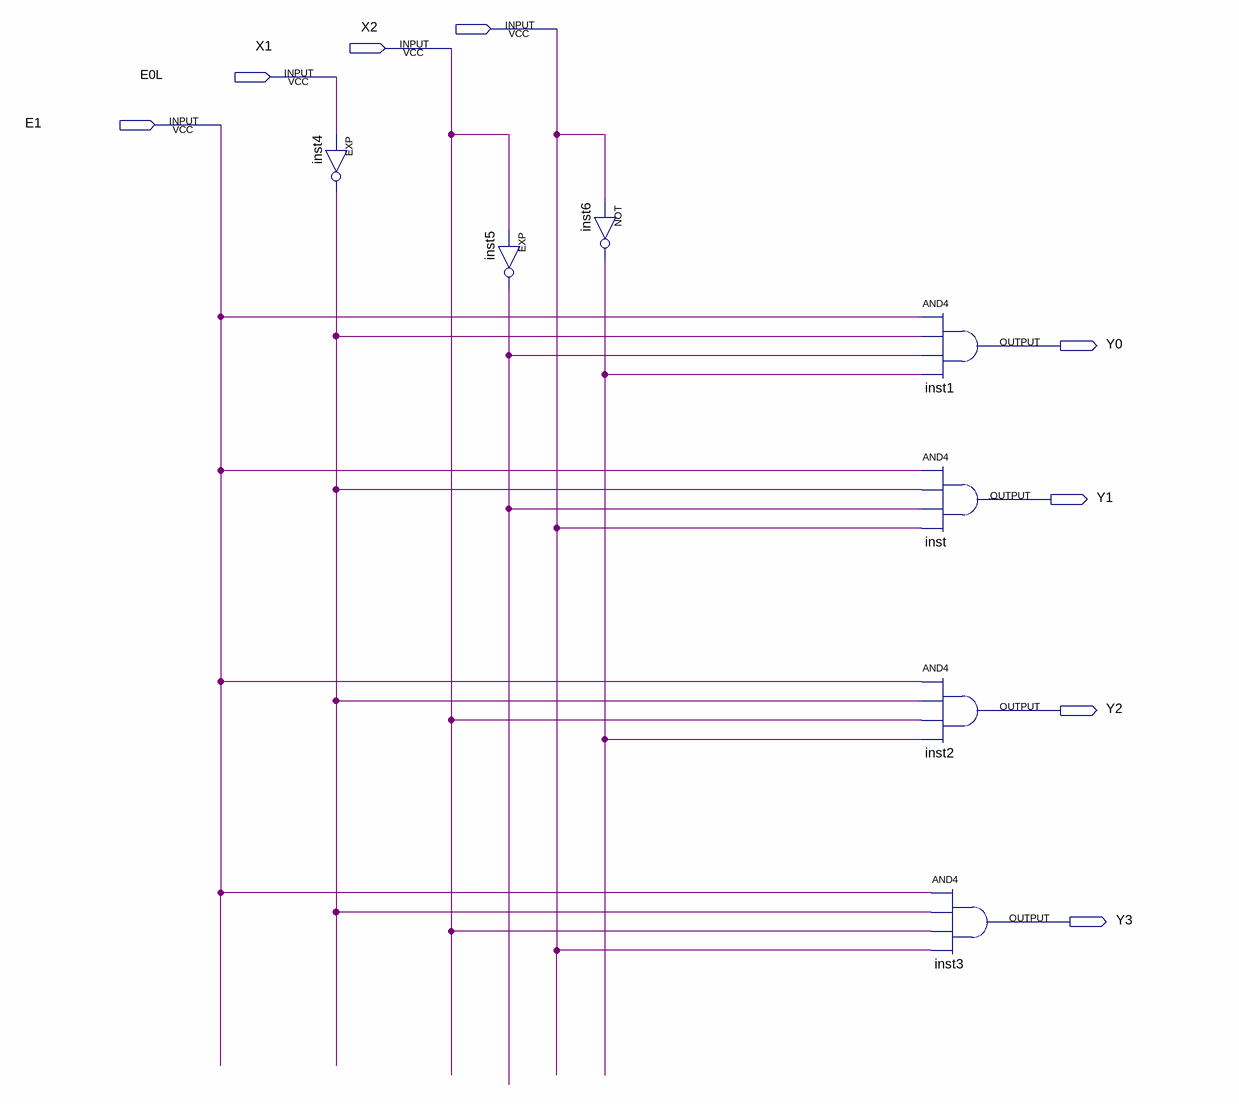
[diagram p0: schematic sheet]
// Quartus schematic Dec2_4.bdf as structural Verilog: 7 symbols, 8 pins
module Dec2_4 (
  input  X2,
  input  X1,
  input  E0L,
  input  E1,
  output Y0,
  output Y1,
  output Y2,
  output Y3
);

  wire inst4_out, inst5_out, inst6_out;

  EXP inst4 (.IN(E0L), .OUT(inst4_out));
  EXP inst5 (.IN(X1), .OUT(inst5_out));
  not inst6 (inst6_out, X2);
  and inst1 (Y0, E1, inst4_out, inst5_out, inst6_out);
  and inst (Y1, E1, inst4_out, inst5_out, X2);
  and inst2 (Y2, E1, inst4_out, X1, inst6_out);
  and inst3 (Y3, E1, inst4_out, X1, X2);
endmodule
